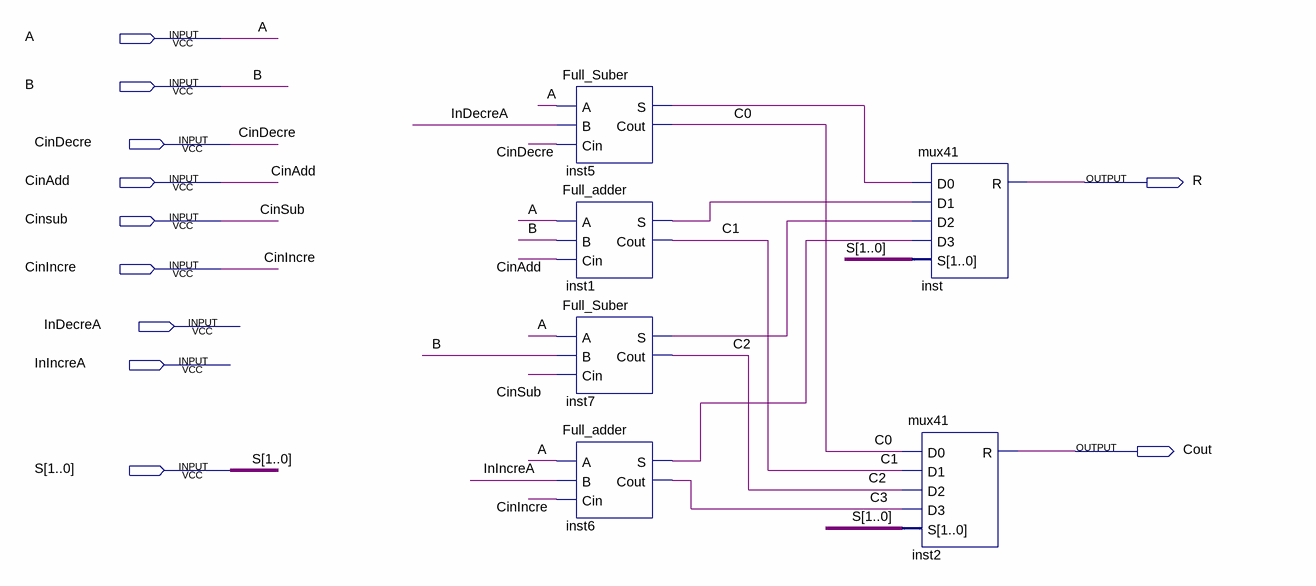
[diagram p0: schematic sheet]
// Quartus schematic AU.bdf as structural Verilog: 6 symbols, 11 pins
module AU (
  input  A,
  input  B,
  input  CinDecre,
  input  CinAdd,
  input  Cinsub,
  input  CinIncre,
  input  InDecreA,
  input  InIncreA,
  input  [1:0] S,
  output R,
  output Cout
);

  wire C0, C1, C2, C3, inst1_s, inst5_s, inst6_s, inst7_s;

  Full_Suber inst5 (.A(A), .B(InDecreA), .Cin(CinDecre), .S(inst5_s), .Cout(C0));
  Full_adder inst1 (.A(A), .B(B), .Cin(CinAdd), .S(inst1_s), .Cout(C1));
  Full_Suber inst7 (.A(A), .B(B), .Cin(Cinsub), .S(inst7_s), .Cout(C2));
  Full_adder inst6 (.A(A), .B(InIncreA), .Cin(CinIncre), .S(inst6_s), .Cout(C3));
  mux41 inst (.D0(inst5_s), .D1(inst1_s), .D2(inst7_s), .D3(inst6_s), .S(S), .R(R));
  mux41 inst2 (.D0(C0), .D1(C1), .D2(C2), .D3(C3), .S(S), .R(Cout));
endmodule
